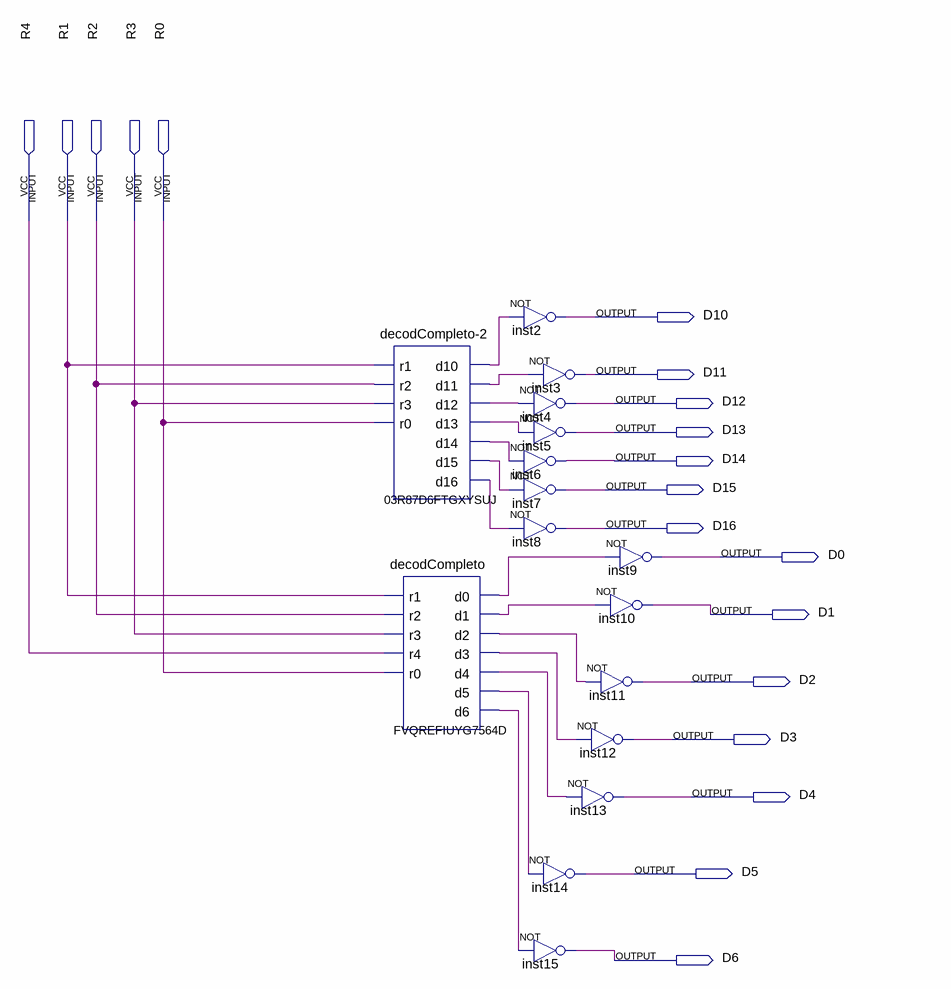
[diagram p0: schematic sheet]
// Quartus schematic DECODER.bdf as structural Verilog: 16 symbols, 19 pins
module DECODER (
  input  R4,
  input  R1,
  input  R2,
  input  R3,
  input  R0,
  output D10,
  output D11,
  output D12,
  output D13,
  output D14,
  output D15,
  output D16,
  output D0,
  output D1,
  output D2,
  output D3,
  output D4,
  output D5,
  output D6
);

  wire FVQREFIUYG7564D_d0, FVQREFIUYG7564D_d1, FVQREFIUYG7564D_d2, FVQREFIUYG7564D_d3, FVQREFIUYG7564D_d4,
       FVQREFIUYG7564D_d5, FVQREFIUYG7564D_d6, n03R87D6FTGXYSUJ_d10, n03R87D6FTGXYSUJ_d11,
       n03R87D6FTGXYSUJ_d12, n03R87D6FTGXYSUJ_d13, n03R87D6FTGXYSUJ_d14, n03R87D6FTGXYSUJ_d15,
       n03R87D6FTGXYSUJ_d16;

  \decodCompleto-2  u_03R87D6FTGXYSUJ (
    .r1(R1), .r2(R2), .r3(R3), .r0(R0), .d10(n03R87D6FTGXYSUJ_d10), .d11(n03R87D6FTGXYSUJ_d11),
    .d12(n03R87D6FTGXYSUJ_d12), .d13(n03R87D6FTGXYSUJ_d13), .d14(n03R87D6FTGXYSUJ_d14),
    .d15(n03R87D6FTGXYSUJ_d15), .d16(n03R87D6FTGXYSUJ_d16));
  decodCompleto FVQREFIUYG7564D (
    .r1(R1), .r2(R2), .r3(R3), .r4(R4), .r0(R0), .d0(FVQREFIUYG7564D_d0), .d1(FVQREFIUYG7564D_d1),
    .d2(FVQREFIUYG7564D_d2), .d3(FVQREFIUYG7564D_d3), .d4(FVQREFIUYG7564D_d4), .d5(FVQREFIUYG7564D_d5),
    .d6(FVQREFIUYG7564D_d6));
  not inst2 (D10, n03R87D6FTGXYSUJ_d10);
  not inst3 (D11, n03R87D6FTGXYSUJ_d11);
  not inst4 (D12, n03R87D6FTGXYSUJ_d12);
  not inst5 (D13, n03R87D6FTGXYSUJ_d13);
  not inst6 (D14, n03R87D6FTGXYSUJ_d14);
  not inst7 (D15, n03R87D6FTGXYSUJ_d15);
  not inst8 (D16, n03R87D6FTGXYSUJ_d16);
  not inst14 (D5, FVQREFIUYG7564D_d5);
  not inst15 (D6, FVQREFIUYG7564D_d6);
  not inst9 (D0, FVQREFIUYG7564D_d0);
  not inst10 (D1, FVQREFIUYG7564D_d1);
  not inst11 (D2, FVQREFIUYG7564D_d2);
  not inst12 (D3, FVQREFIUYG7564D_d3);
  not inst13 (D4, FVQREFIUYG7564D_d4);
endmodule
